# Altium schematic sheet Sensor_LM35_Connector.SchDoc
size 88 x 25 mm
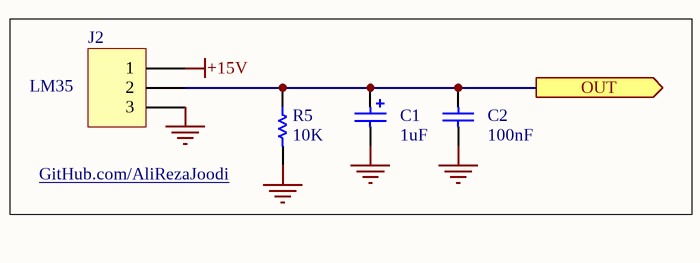
[diagram p0: Sensor_LM35_Connector.SchDoc]

## Parts
C1  1uF  [CAPPR2.5-6.3x5]
C2  100nF  [CAPNTO2.54-3.05x1.78A]
J2  3PIN  [Fonics_3PIN_1]  (value not drawn)
R5  10K  [AXIAL-0.4]

## Ports
OUT (out)

## Nets
+15V: J2.1
GND: C1.2 C2.1 J2.3 R5.2
OUT: C1.1 C2.2 J2.2 R5.1 ; port OUT

## Notes on the sheet
- LM35
- GitHub.com/AliRezaJoodi

## Library data of the parts
C1 = Cap Pol1: Polarized Capacitor (Radial); Manufacturer: Generic Components; Class I: Passive; Published: 8-Jun-2000; Revision: July-2002: Re-released for DXP Platform.; Publisher: Altium Limited; Class II: Capacitor
C2 = Cap: Capacitor; Manufacturer: Generic Components; Class I: Passive; Published: 8-Jun-2000; Revision: July-2002: Re-released for DXP Platform.; Publisher: Altium Limited; Class II: Capacitor
J2 = Header 3: Header, 3-Pin; Manufacturer: Generic Components; Class I: Connector; Revision: July-2002: Re-released for DXP Platform.; Publisher: Altium Limited
R5 = Res1: Resistor; Published: 8-Jun-2000; LatestRevisionDate: 17-Jul-2002; LatestRevisionNote: Re-released for DXP Platform.; PackageReference: AXIAL-0.3; Publisher: Altium Limited